# Altium schematic sheet nm_main.SchDoc: =GlobalProjectName
size 410 x 297 mm; SheetNumber: 1; SheetTotal: 9; PageSetup: Record=PageOptions|CenterHorizontal=True|CenterVertical=True|PrintScale=1.00|XCorrection=1.00|YCorrection=1.00|PrintKind=1|BorderSize=5000000|LeftOffset=0|BottomOffset=0|Orientation=2|PaperLength=1000|PaperWidth=1000|Scale=100|PaperSource=15|PrintQuality=1200|MediaType=1|DitherType=10|PaperKind=A3|PrintScaleMode=1; Weight: -; ScaleFactor: -
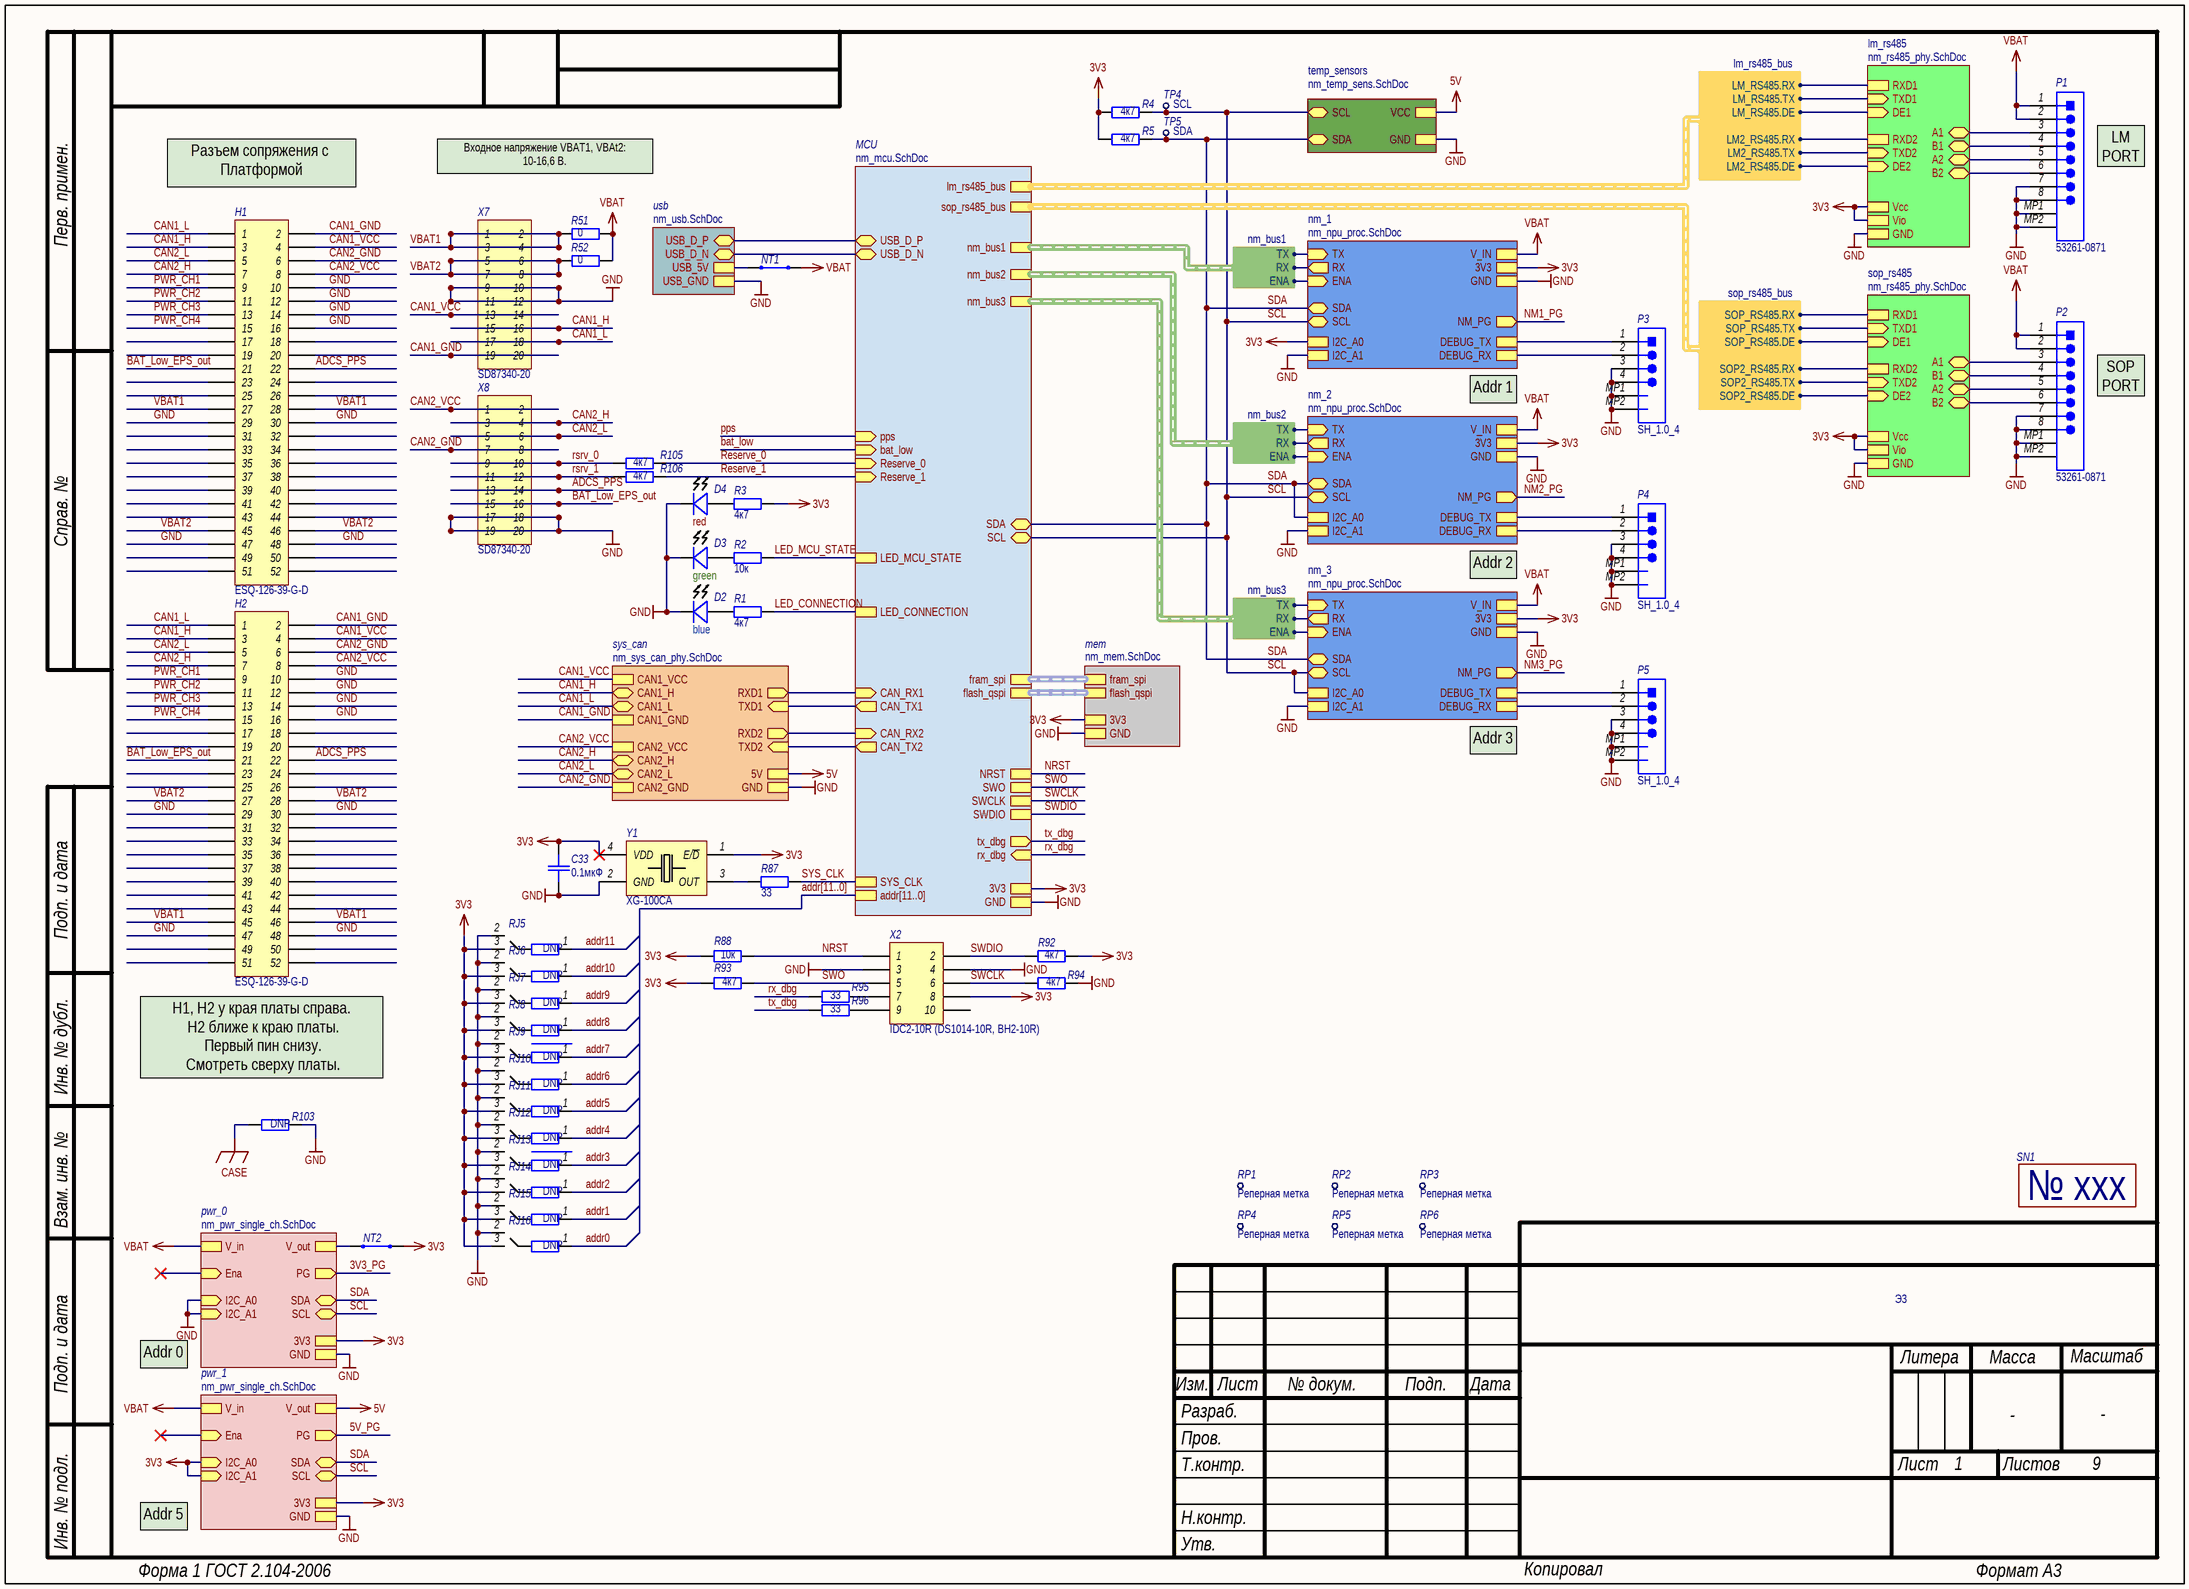
[diagram p0: nm_main.SchDoc]

## Parts
C33  0.1мкФ  [SMD_C0603]
D2  value blue  [LED_0603]  (hidden comment: LED)
D3  value green  [LED_0603]  (hidden comment: LED)
D4  value red  [LED_0603]  (hidden comment: LED)
H1  ESQ-126-39-G-D  [ESQ-126-39-G-D]
H2  ESQ-126-39-G-D  [ESQ-126-39-G-D]
NT1  OSM R1-8  [NetTie_1mm]  (value not drawn)  (net tie, no BOM)
NT2  OSM R1-8  [NetTie_1mm]  (value not drawn)  (net tie, no BOM)
P1  53261-0871  [53261-0871]
P2  53261-0871  [53261-0871]
P3  SH_1.0_4  [53261-0471]
P4  SH_1.0_4  [53261-0471]
P5  SH_1.0_4  [53261-0471]
R1  4к7  [SMD_0603]
R2  10к  [SMD_0603]
R3  4к7  [SMD_0603]
R4  4к7  [SMD_0603]
R5  4к7  [SMD_0603]
R51  0  [SMD_1206]
R52  0  [SMD_1206]
R87  33  [SMD_0603]
R88  value 10к  [SMD_0603]  (hidden comment: Resistor)
R92  4к7  [SMD_0603]
R93  4к7  [SMD_0603]
R94  4к7  [SMD_0603]
R95  33  [SMD_0603]
R96  33  [SMD_0603]
R103  DNP  [SMD_0805]
R105  4к7  [SMD_0603]
R106  4к7  [SMD_0603]
RJ5  value DNP  [SMD_JMP_0402]  (hidden comment: OSM R1-8)
RJ6  value DNP  [SMD_JMP_0402]  (hidden comment: OSM R1-8)
RJ7  value DNP  [SMD_JMP_0402]  (hidden comment: OSM R1-8)
RJ8  value DNP  [SMD_JMP_0402]  (hidden comment: OSM R1-8)
RJ9  value DNP  [SMD_JMP_0402]  (hidden comment: OSM R1-8)
RJ10  value DNP  [SMD_JMP_0402]  (hidden comment: OSM R1-8)
RJ11  value DNP  [SMD_JMP_0402]  (hidden comment: OSM R1-8)
RJ12  value DNP  [SMD_JMP_0402]  (hidden comment: OSM R1-8)
RJ13  value DNP  [SMD_JMP_0402]  (hidden comment: OSM R1-8)
RJ14  value DNP  [SMD_JMP_0402]  (hidden comment: OSM R1-8)
RJ15  value DNP  [SMD_JMP_0402]  (hidden comment: OSM R1-8)
RJ16  value DNP  [SMD_JMP_0402]  (hidden comment: OSM R1-8)
RP1  Наименование: Реперная метка  [ReperPoint]  (hidden comment: RP)  (no BOM)
RP2  Наименование: Реперная метка  [ReperPoint]  (hidden comment: RP)  (no BOM)
RP3  Наименование: Реперная метка  [ReperPoint]  (hidden comment: RP)  (no BOM)
RP4  Наименование: Реперная метка  [ReperPoint]  (hidden comment: RP)  (no BOM)
RP5  Наименование: Реперная метка  [ReperPoint]  (hidden comment: RP)  (no BOM)
RP6  Наименование: Реперная метка  [ReperPoint]  (hidden comment: RP)  (no BOM)
SN1  Место под нанесение серийного номера  [Serial_number_v2]  (value not drawn)  (graphical)
TP4  SCL  [TP_PAD_1]  (no BOM)
TP5  SDA  [TP_PAD_1]  (no BOM)
X2  Наименование: IDC2-10R (DS1014-10R, BH2-10R)  [IDC2-10R]  (hidden comment: Header 2X10)
X7  Наименование: SD87340-20  [PLD2-20_SD87340-20]  (hidden comment: Header 2X20)
X8  Наименование: SD87340-20  [PLD2-20_SD87340-20]  (hidden comment: Header 2X20)
Y1  Наименование: XG-100CA  [SMD_7050_Crystal_Oscillator]  (hidden comment: XG-1000CA)

## Sub-sheets
lm_rs485 = nm_rs485_phy.SchDoc: A1 (bidir), RXD1, TXD1 (in), DE1 (in), B1 (bidir), A2 (bidir), RXD2, TXD2 (in), DE2 (in), B2 (bidir), Vcc, Vio, GND
MCU = nm_mcu.SchDoc: SDA (bidir), SCL (bidir), USB_D_P (bidir), USB_D_N (bidir), pps (in), LED_MCU_STATE, LED_CONNECTION, bat_low (in), CAN_TX2 (out), CAN_RX2 (in), CAN_TX1 (out), CAN_RX1 (in), SYS_CLK, NRST, tx_dbg (out), SWO, rx_dbg (in), SWCLK, GND, SWDIO, 3V3, fram_spi, flash_qspi, Reserve_0 (in), Reserve_1 (in), addr[11..0], nm_bus1 (harness nm_bus1), nm_bus2 (harness nm_bus2), nm_bus3 (harness nm_bus3), lm_rs485_bus (harness lm_rs485_bus), sop_rs485_bus (harness sop_rs485_bus)
mem = nm_mem.SchDoc: 3V3, GND, fram_spi (harness fram_spi), flash_qspi (harness flash_qspi)
nm_1 = nm_npu_proc.SchDoc: GND, V_IN, TX (in), RX (out), 3V3, ENA (in), I2C_A0, I2C_A1, SCL (bidir), SDA (bidir), NM_PG (out), DEBUG_TX, DEBUG_RX
nm_2 = nm_npu_proc.SchDoc: GND, V_IN, TX (in), RX (out), 3V3, ENA (in), I2C_A0, I2C_A1, SCL (bidir), SDA (bidir), NM_PG (out), DEBUG_TX, DEBUG_RX
nm_3 = nm_npu_proc.SchDoc: GND, V_IN, TX (in), RX (out), DEBUG_TX, DEBUG_RX, 3V3, ENA (in), I2C_A0, I2C_A1, SCL (bidir), SDA (bidir), NM_PG (out)
pwr_0 = nm_pwr_single_ch.SchDoc: Ena (in), V_in, PG (out), GND, V_out, SCL (bidir), SDA (bidir), I2C_A0 (in), I2C_A1 (in), 3V3  | TP_STR: 3V3; R1_Value: 150к; R2_Value: 47к; R_efuse1_mid: 120к; R_efuse1_bot: 43к; R_efuse1_ilim: 3к3; R_pwr_led: 4к7; R_efuse2_bot: 270к; R_efuse1_top: 470к; R_efuse2_mid: 91к; R_efuse2_ilim: 1к1; R_efuse2_top: 470к; C_efuse2_dVdT: 10нФ; C_efuse2_itimer: 2.4нФ
pwr_1 = nm_pwr_single_ch.SchDoc: Ena (in), V_in, PG (out), GND, V_out, SCL (bidir), SDA (bidir), I2C_A0 (in), I2C_A1 (in), 3V3  | TP_STR: 5V0; R1_Value: 160к; R2_Value: 30к; R_efuse1_mid: 120к; R_efuse1_bot: 43к; R_efuse1_ilim: 3к3; R_pwr_led: 4к7; R_efuse2_bot: 130к; R_efuse2_mid: 62к; R_efuse2_ilim: 3к3; R_efuse1_top: 470к; R_efuse2_top: 470к; C_efuse2_dVdT: 10нФ; C_efuse2_itimer: 2.4нФ
sop_rs485 = nm_rs485_phy.SchDoc: A1 (bidir), RXD1, TXD1 (in), DE1 (in), B1 (bidir), A2 (bidir), RXD2, TXD2 (in), DE2 (in), B2 (bidir), Vcc, Vio, GND
sys_can = nm_sys_can_phy.SchDoc: CAN1_GND, CAN2_H (bidir), CAN2_L (bidir), TXD2 (in), CAN2_GND, CAN1_H (bidir), RXD2 (out), TXD1 (in), CAN2_VCC, CAN1_L (bidir), RXD1 (out), CAN1_VCC, 5V, GND
temp_sensors = nm_temp_sens.SchDoc: VCC, GND, SDA (bidir), SCL (bidir)
usb = nm_usb.SchDoc: USB_D_P (bidir), USB_D_N (bidir), USB_5V, USB_GND

## Harnesses
nm_bus1: TX, RX, ENA
nm_bus2: TX, RX, ENA
nm_bus3: TX, RX, ENA
lm_rs485_bus: LM_RS485.RX, LM_RS485.TX, LM_RS485.DE, LM2_RS485.RX, LM2_RS485.TX, LM2_RS485.DE
sop_rs485_bus: SOP_RS485.RX, SOP_RS485.TX, SOP_RS485.DE, SOP2_RS485.RX, SOP2_RS485.TX, SOP2_RS485.DE

## Nets
3V3: C33.2 NT2.2 R3.1 R4.2 R5.2 R88.1 R92.2 R93.2 RJ5.3 RJ6.3 RJ7.3 RJ8.3 RJ9.3 RJ10.3 RJ11.3 RJ12.3 RJ13.3 RJ14.3 RJ15.3 RJ16.3 X2.8 Y1.1(E/~{D}) Y1.4(VDD) ; sheet MCU/3V3, sheet pwr_0/3V3, sheet mem/3V3, sheet pwr_1/I2C_A0, sheet pwr_1/I2C_A1, sheet pwr_1/3V3, sheet nm_3/3V3, sheet lm_rs485/Vcc, sheet lm_rs485/Vio, sheet nm_2/3V3, sheet nm_1/3V3, sheet nm_1/I2C_A0, sheet sop_rs485/Vcc, sheet sop_rs485/Vio
5V: sheet sys_can/5V, sheet pwr_1/V_out, sheet temp_sensors/VCC
CASE: R103.2
GND: C33.1 D2.2(K) D3.2(K) D4.2(K) H1.10 H1.12 H1.14 H1.16 H1.29 H1.30 H1.47 H1.48 H2.10 H2.12 H2.14 H2.16 H2.29 H2.30 H2.47 H2.48 P1.7 P1.8 P1.MP1 P1.MP2 P2.7 P2.8 P2.MP1 P2.MP2 P3.3 P3.4 P3.MP1 P3.MP2 P4.3 P4.4 P4.MP1 P4.MP2 P5.3 P5.4 P5.MP1 P5.MP2 R94.1 R103.1 RJ5.2 RJ6.2 RJ7.2 RJ8.2 RJ9.2 RJ10.2 RJ11.2 RJ12.2 RJ13.2 RJ14.2 RJ15.2 RJ16.2 X2.3 X2.4 X7.9 X7.10 X7.11 X7.12 X8.17 X8.18 X8.19 X8.20 Y1.2(GND) ; sheet MCU/GND, sheet usb/USB_GND, sheet pwr_0/GND, sheet pwr_0/I2C_A0, sheet pwr_0/I2C_A1, sheet mem/GND, sheet sys_can/GND, sheet pwr_1/GND, sheet nm_3/GND, sheet nm_3/I2C_A1, sheet lm_rs485/GND, sheet nm_2/GND, sheet nm_2/I2C_A1, sheet nm_1/GND, sheet nm_1/I2C_A1, sheet sop_rs485/GND, sheet temp_sensors/GND
VBAT: NT1.2 P1.1 P1.2 P2.1 P2.2 R51.2 R52.2 ; sheet pwr_0/V_in, sheet pwr_1/V_in, sheet nm_3/V_IN, sheet nm_2/V_IN, sheet nm_1/V_IN
3V3_PG: sheet pwr_0/PG
5V_PG: sheet pwr_1/PG
ADCS_PPS: H1.22 H2.22 X8.13 X8.14
addr0: RJ16.1
addr1: RJ15.1
addr2: RJ14.1
addr3: RJ13.1
addr4: RJ12.1
addr5: RJ11.1
addr6: RJ10.1
addr7: RJ9.1
addr8: RJ8.1
addr9: RJ7.1
addr10: RJ6.1
addr11: RJ5.1
bat_low: sheet MCU/bat_low
BAT_Low_EPS_out: H1.21 H2.21 X8.15 X8.16
CAN1_GND: H1.2 H2.2 X7.19 X7.20 ; sheet sys_can/CAN1_GND
CAN1_H: H1.3 H2.3 X7.15 X7.16 ; sheet sys_can/CAN1_H
CAN1_L: H1.1 H2.1 X7.17 X7.18 ; sheet sys_can/CAN1_L
CAN1_VCC: H1.4 H2.4 X7.13 X7.14 ; sheet sys_can/CAN1_VCC
CAN2_GND: H1.6 H2.6 X8.7 X8.8 ; sheet sys_can/CAN2_GND
CAN2_H: H1.7 H2.7 X8.3 X8.4 ; sheet sys_can/CAN2_H
CAN2_L: H1.5 H2.5 X8.5 X8.6 ; sheet sys_can/CAN2_L
CAN2_VCC: H1.8 H2.8 X8.1 X8.2 ; sheet sys_can/CAN2_VCC
LED_CONNECTION: R1.1 ; sheet MCU/LED_CONNECTION
LED_MCU_STATE: R2.1 ; sheet MCU/LED_MCU_STATE
NM1_PG: sheet nm_1/NM_PG
NM2_PG: sheet nm_2/NM_PG
NM3_PG: sheet nm_3/NM_PG
NRST: R88.2 X2.1 ; sheet MCU/NRST
pps: sheet MCU/pps
PWR_CH1: H1.9 H2.9
PWR_CH2: H1.11 H2.11
PWR_CH3: H1.13 H2.13
PWR_CH4: H1.15 H2.15
Reserve_0: R105.1 ; sheet MCU/Reserve_0
Reserve_1: R106.1 ; sheet MCU/Reserve_1
rsrv_0: R105.2 X8.9 X8.10
rsrv_1: R106.2 X8.11 X8.12
rx_dbg: R95.1 ; sheet MCU/rx_dbg
SCL: R4.1 TP4.0(TP) ; sheet MCU/SCL, sheet pwr_0/SCL, sheet pwr_1/SCL, sheet nm_3/I2C_A0, sheet nm_3/SCL, sheet nm_2/SCL, sheet nm_1/SCL, sheet temp_sensors/SCL
SDA: R5.1 TP5.0(TP) ; sheet MCU/SDA, sheet pwr_0/SDA, sheet pwr_1/SDA, sheet nm_3/SDA, sheet nm_2/I2C_A0, sheet nm_2/SDA, sheet nm_1/SDA, sheet temp_sensors/SDA
SWCLK: R94.2 X2.6 ; sheet MCU/SWCLK
SWDIO: R92.1 X2.2 ; sheet MCU/SWDIO
SWO: R93.1 X2.5 ; sheet MCU/SWO
SYS_CLK: R87.2 ; sheet MCU/SYS_CLK
tx_dbg: R96.1 ; sheet MCU/tx_dbg
VBAT1: H1.27 H1.28 H2.45 H2.46 R51.1 X7.1 X7.2 X7.3 X7.4
VBAT2: H1.45 H1.46 H2.27 H2.28 R52.1 X7.5 X7.6 X7.7 X7.8
NetD2_1: D2.1(A) R1.2
NetD3_1: D3.1(A) R2.2
NetD4_1: D4.1(A) R3.2
NetNT1_1: NT1.1 ; sheet usb/USB_5V
NetNT2_1: NT2.1 ; sheet pwr_0/V_out
NetP1_3: P1.3 ; sheet lm_rs485/A1
NetP1_4: P1.4 ; sheet lm_rs485/B1
NetP1_5: P1.5 ; sheet lm_rs485/A2
NetP1_6: P1.6 ; sheet lm_rs485/B2
NetP2_3: P2.3 ; sheet sop_rs485/A1
NetP2_4: P2.4 ; sheet sop_rs485/B1
NetP2_5: P2.5 ; sheet sop_rs485/A2
NetP2_6: P2.6 ; sheet sop_rs485/B2
NetP3_1: P3.1 ; sheet nm_1/DEBUG_TX
NetP3_2: P3.2 ; sheet nm_1/DEBUG_RX
NetP4_1: P4.1 ; sheet nm_2/DEBUG_TX
NetP4_2: P4.2 ; sheet nm_2/DEBUG_RX
NetP5_1: P5.1 ; sheet nm_3/DEBUG_TX
NetP5_2: P5.2 ; sheet nm_3/DEBUG_RX
NetR87_1: R87.1 Y1.3(OUT)
NetR95_2: R95.2 X2.7
NetR96_2: R96.2 X2.9
(unnamed): sheet MCU/USB_D_P, sheet usb/USB_D_P
(unnamed): sheet MCU/USB_D_N, sheet usb/USB_D_N
(unnamed): sheet MCU/CAN_TX2, sheet sys_can/TXD2
(unnamed): sheet MCU/CAN_RX2, sheet sys_can/RXD2
(unnamed): sheet MCU/CAN_TX1, sheet sys_can/TXD1
(unnamed): sheet MCU/CAN_RX1, sheet sys_can/RXD1
(unnamed): sheet nm_3/TX, sheet MCU/nm_bus3.TX
(unnamed): sheet nm_3/RX, sheet MCU/nm_bus3.RX
(unnamed): sheet nm_3/ENA, sheet MCU/nm_bus3.ENA
(unnamed): sheet lm_rs485/RXD1, sheet MCU/lm_rs485_bus.LM_RS485.RX
(unnamed): sheet lm_rs485/TXD1, sheet MCU/lm_rs485_bus.LM_RS485.TX
(unnamed): sheet lm_rs485/DE1, sheet MCU/lm_rs485_bus.LM_RS485.DE
(unnamed): sheet lm_rs485/RXD2, sheet MCU/lm_rs485_bus.LM2_RS485.RX
(unnamed): sheet lm_rs485/TXD2, sheet MCU/lm_rs485_bus.LM2_RS485.TX
(unnamed): sheet lm_rs485/DE2, sheet MCU/lm_rs485_bus.LM2_RS485.DE
(unnamed): sheet nm_2/TX, sheet MCU/nm_bus2.TX
(unnamed): sheet nm_2/RX, sheet MCU/nm_bus2.RX
(unnamed): sheet nm_2/ENA, sheet MCU/nm_bus2.ENA
(unnamed): sheet nm_1/TX, sheet MCU/nm_bus1.TX
(unnamed): sheet nm_1/RX, sheet MCU/nm_bus1.RX
(unnamed): sheet nm_1/ENA, sheet MCU/nm_bus1.ENA
(unnamed): sheet sop_rs485/RXD1, sheet MCU/sop_rs485_bus.SOP_RS485.RX
(unnamed): sheet sop_rs485/TXD1, sheet MCU/sop_rs485_bus.SOP_RS485.TX
(unnamed): sheet sop_rs485/DE1, sheet MCU/sop_rs485_bus.SOP_RS485.DE
(unnamed): sheet sop_rs485/RXD2, sheet MCU/sop_rs485_bus.SOP2_RS485.RX
(unnamed): sheet sop_rs485/TXD2, sheet MCU/sop_rs485_bus.SOP2_RS485.TX
(unnamed): sheet sop_rs485/DE2, sheet MCU/sop_rs485_bus.SOP2_RS485.DE

Not connected (* = marked no-connect by the designer): H1 17 18 19 20 23 24 25 26 31 32 33 34 35 36 37 38 39 40 41 42 43 44 49 50 51 52; H2 17 18 19 20 23 24 25 26 31 32 33 34 35 36 37 38 39 40 41 42 43 44 49 50 51 52; X2 10

## Buses and harness runs
bus addr[11..0] = sheet MCU/addr[11..0]
harness sheet MCU/flash_qspi = sheet mem/flash_qspi
harness sheet MCU/fram_spi = sheet mem/fram_spi

## Notes on the sheet
- (near H1) Разъем сопряжения с
  Платформой
- Входное напряжение VBAT1, VBAt2:
  10-16,6 В.
- (near P1) LM PORT
- Addr 1
- (near P2) SOP
  PORT
- Addr 2
- Addr 3
- H1, H2 у края платы справа.
  H2 ближе к краю платы.
  Первый пин снизу.
  Смотреть сверху платы.
- Addr 0
- Addr 5
- Перв. примен.
- Справ. №
- Подп. и дата
- Инв. № дубл.
- Взам. инв. №
- Э3
- Изм.
- Разраб.
- Лист
- № докум.
- Подп.
- Дата
- Литера
- Масса
- Масштаб
- Пров.
- Т.контр.
- Листов
- Н.контр.
- Утв.
- Инв. № подл.
- Форма 1 ГОСТ 2.104-2006
- Копировал
- Формат А3
- (in symbol Serial_number) № xxx

## Library data of the parts
C33 = Capacitor: Назначение: SMD-конденсатор; Наименование: Конденсатор; Потребление, Вт: 0; Точность: %; Напряжение: В; Value: 0.1мкФ; Диэлектрик: *; Place_v1: *; Place_v2: *
D2-D4 = LED: Назначение: Светодиод; Наименование: SMD-LED; Потребление, Вт: 0,01; Place_v1: *; Place_v2: *
H1 H2 = ESQ-126-39-G-D: Elevated socket, dual-row, 26-pin per row; Назначение: Сквозной разъем, двойно, 52 контакта, шаг 2,54 мм; Потребление, Вт: 0,00; Place_v2: DNP; ComponentLink1Description: DataSheet; ComponentLink1URL: https://static.chipdip.ru/lib/071/DOC025071643.pdf; Наименование: ESQ-126-39-G-D
NT1 NT2 = NetTie: Different Nets connection; Потребление, Вт: 0,001; Value: 0; Наименование: NetTie; Назначение: NetTie; Place_v1: *; Place_v2: *
P1 P2 = PicoBlade_53261-0871: Male Header, Pitch 1.25 mm, 1 x 8 Position, Height 3.4 mm, -40 to 85 degC, RoHS, Tape and Reel; Потребление, Вт: 0.0; Назначение: Male Header, Pitch 1.25 mm, 1 x 8 Position, Height 3.4 mm, -40 to 85 degC, RoHS, Tape and Reel; ComponentLink1Description: DataSheet; ComponentLink1URL: http://www.molex.com/pdm_docs/sd/532610671_sd.pdf; Наименование: 53261-0871
P3-P5 = SH_1.0_4: JST SH1.0, 1.0 mm pitch/Disconnactable crimp style connectors; Потребление, Вт: 0.0; Назначение: JST SH1.0, 1.0 mm pitch/Disconnactable crimp style connectors; ComponentLink1Description: DataSheet; ComponentLink1URL: https://www.jst-mfg.com/product/pdf/eng/eSH.pdf; Наименование: SH_1.0_4
R1-R3 R87 R95 R96 R105 R106 = Resistor: Наименование: Резистор; Назначение: SMD-резистор; Потребление, Вт: 0,001
  R1 R3: Value: 4к7; Place_v1: *; Place_v2: *
  R2: Value: 10к; Place_v1: *; Place_v2: *
  R87 R95 R96: Value: 33; Place_v1: *; Place_v2: *
  R105 R106: Value: 4к7
R4 R5 R92-R94 R103 = Resistor: Наименование: Резистор; Назначение: SMD-резистор; Потребление, Вт: 0,001; Описание: Резистор 0603 10K ±1% 100ppm/°C; Place_v1: *; Place_v2: *
  R4 R5 R92-R94: Value: 4к7
  R103: Value: DNP
R51 = Resistor: Наименование: Резистор; Назначение: SMD-резистор; Потребление, Вт: 0,001; Place_v2: DNP; Value: 0
R52 = Resistor: Наименование: Резистор; Назначение: SMD-резистор; Потребление, Вт: 0,001; Place_v1: DNP; Value: 0
R88 = Resistor: Наименование: Резистор; Назначение: SMD-резистор; Потребление, Вт: 0,001; Точность: %; Place_v1: *; Place_v2: *
RJ5-RJ16 = Resistor_Jamper: Resistor-Jumper; Назначение: Резистор для выбора режима; Наименование: Резистор; Потребление, Вт: 0,0; Place_v1: *; Place_v2: *
RP1-RP6 = RP: Назначение: реперная метка для автоматического монтажа; Place_v1: *; Place_v2: *
SN1 = Serial_number: Потребление, Вт: 0; Назначение: Место под нанесение серийного номера; Наименование: Место под нанесение серийного номера; Place_v1: *; Place_v2: *
TP4 TP5 = TP: Наименование: Точка проверки; Назначение: Контроль параметров платы; Place_v1: *; Place_v2: *
  TP4: TP_Name: SCL
  TP5: TP_Name: SDA
X2 = Header 2X10: Header, 10-Pin, Dual row; Назначение: Header, 10-Pin, Dual row, R/A; Потребление, Вт: 0,0
X7 X8 = Header 2X20: Header, 20-Pin, Dual row; Потребление, Вт: 0,0; Place_v2: DNP; Примечание: Для монтажа из 2-х 10-pin необходимо сточить край разъема; Назначение: Header, 20-Pin, Dual row
Y1 = Crystal_Oscillator: Crystall oscillator, CMOS, 3.3V, SMD7050; Назначение: Crystall oscillator, CMOS, 3.3V, SMD7050, 10 МГц; Потребление, Вт: 0.12; ComponentLink1Description: DataSheet; ComponentLink1URL: https://ru.mouser.com/datasheet/2/137/G_1000CA_en-1003255.pdf; Place_v1: *; Place_v2: *